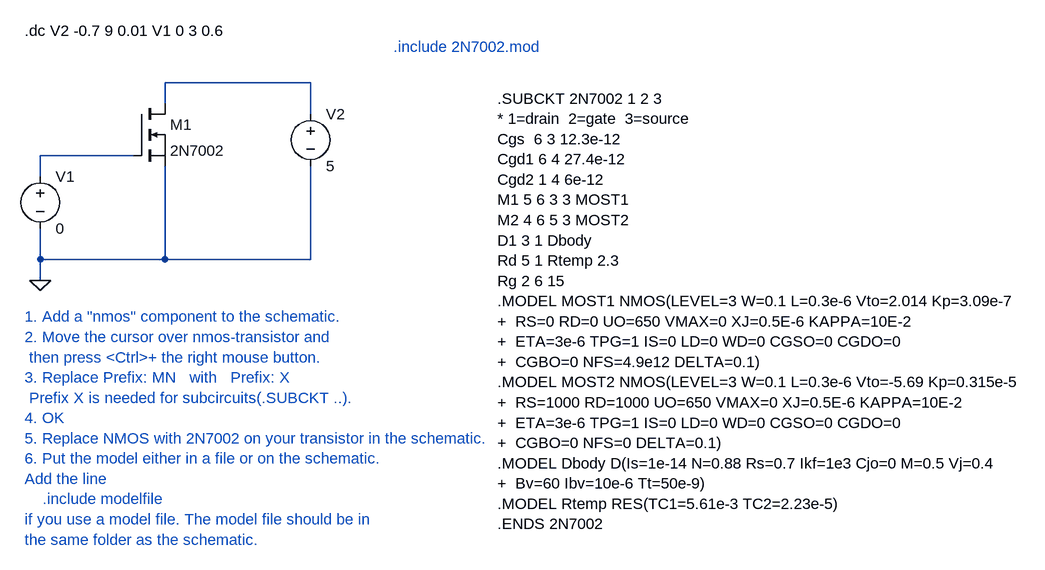
[diagram p0: schematic 2n7002.asc]
2n7002.asc, the LTspice schematic file:
Version 4
SHEET 1 1208 812
WIRE -448 432 -448 400
WIRE -448 272 -448 240
WIRE -448 240 -304 240
WIRE -256 128 -256 160
WIRE -256 256 -256 400
WIRE -256 400 -448 400
WIRE -448 400 -448 352
WIRE -32 176 -32 128
WIRE -32 128 -256 128
WIRE -256 400 -32 400
WIRE -32 400 -32 256
FLAG -448 432 0
SYMBOL voltage -448 256 R0
SYMATTR InstName V1
SYMATTR Value 0
SYMBOL nmos -304 160 R0
SYMATTR InstName M1
SYMATTR Value 2N7002
SYMATTR Prefix X
SYMBOL voltage -32 160 R0
SYMATTR InstName V2
SYMATTR Value 5
TEXT 256 152 Left 0 !.SUBCKT 2N7002 1 2 3\n* 1=drain  2=gate  3=source\nCgs  6 3 12.3e-12\nCgd1 6 4 27.4e-12\nCgd2 1 4 6e-12\nM1 5 6 3 3 MOST1\nM2 4 6 5 3 MOST2\nD1 3 1 Dbody\nRd 5 1 Rtemp 2.3\nRg 2 6 15\n.MODEL MOST1 NMOS(LEVEL=3 W=0.1 L=0.3e-6 Vto=2.014 Kp=3.09e-7\n+  RS=0 RD=0 UO=650 VMAX=0 XJ=0.5E-6 KAPPA=10E-2\n+  ETA=3e-6 TPG=1 IS=0 LD=0 WD=0 CGSO=0 CGDO=0\n+  CGBO=0 NFS=4.9e12 DELTA=0.1)\n.MODEL MOST2 NMOS(LEVEL=3 W=0.1 L=0.3e-6 Vto=-5.69 Kp=0.315e-5\n+  RS=1000 RD=1000 UO=650 VMAX=0 XJ=0.5E-6 KAPPA=10E-2\n+  ETA=3e-6 TPG=1 IS=0 LD=0 WD=0 CGSO=0 CGDO=0\n+  CGBO=0 NFS=0 DELTA=0.1)\n.MODEL Dbody D(Is=1e-14 N=0.88 Rs=0.7 Ikf=1e3 Cjo=0 M=0.5 Vj=0.4\n+  Bv=60 Ibv=10e-6 Tt=50e-9)\n.MODEL Rtemp RES(TC1=5.61e-3 TC2=2.23e-5)\n.ENDS 2N7002
TEXT -472 48 Left 0 !.dc V2 -0.7 9 0.01 V1 0 3 0.6
TEXT -472 488 Left 0 ;1. Add a "nmos" component to the schematic.\n2. Move the cursor over nmos-transistor and \n then press <Ctrl>+ the right mouse button.\n3. Replace Prefix: MN   with   Prefix: X\n Prefix X is needed for subcircuits(.SUBCKT ..).\n4. OK\n5. Replace NMOS with 2N7002 on your transistor in the schematic.\n6. Put the model either in a file or on the schematic.\nAdd the line  \n    .include modelfile  \nif you use a model file. The model file should be in\nthe same folder as the schematic.
TEXT 96 72 Left 0 ;.include 2N7002.mod

The netlist it stands for:
* 2n7002.asc
V1 N001 0 0
XM1 N002 N001 0 2N7002  ; pins D G S
V2 N002 0 5
.SUBCKT 2N7002 1 2 3
* 1=drain  2=gate  3=source
Cgs  6 3 12.3e-12
Cgd1 6 4 27.4e-12
Cgd2 1 4 6e-12
M1 5 6 3 3 MOST1
M2 4 6 5 3 MOST2
D1 3 1 Dbody
Rd 5 1 Rtemp 2.3
Rg 2 6 15
.MODEL MOST1 NMOS(LEVEL=3 W=0.1 L=0.3e-6 Vto=2.014 Kp=3.09e-7
+  RS=0 RD=0 UO=650 VMAX=0 XJ=0.5E-6 KAPPA=10E-2
+  ETA=3e-6 TPG=1 IS=0 LD=0 WD=0 CGSO=0 CGDO=0
+  CGBO=0 NFS=4.9e12 DELTA=0.1)
.MODEL MOST2 NMOS(LEVEL=3 W=0.1 L=0.3e-6 Vto=-5.69 Kp=0.315e-5
+  RS=1000 RD=1000 UO=650 VMAX=0 XJ=0.5E-6 KAPPA=10E-2
+  ETA=3e-6 TPG=1 IS=0 LD=0 WD=0 CGSO=0 CGDO=0
+  CGBO=0 NFS=0 DELTA=0.1)
.MODEL Dbody D(Is=1e-14 N=0.88 Rs=0.7 Ikf=1e3 Cjo=0 M=0.5 Vj=0.4
+  Bv=60 Ibv=10e-6 Tt=50e-9)
.MODEL Rtemp RES(TC1=5.61e-3 TC2=2.23e-5)
.ENDS 2N7002
.dc V2 -0.7 9 0.01 V1 0 3 0.6
* 1. Add a "nmos" component to the schematic.
* 2. Move the cursor over nmos-transistor and
*  then press <Ctrl>+ the right mouse button.
* 3. Replace Prefix: MN   with   Prefix: X
*  Prefix X is needed for subcircuits(.SUBCKT ..).
* 4. OK
* 5. Replace NMOS with 2N7002 on your transistor in the schematic.
* 6. Put the model either in a file or on the schematic.
* Add the line
*     .include modelfile
* if you use a model file. The model file should be in
* the same folder as the schematic.
* .include 2N7002.mod
.backanno
.end